# EAGLE design ColourWatch (EAGLE 7.6.0)
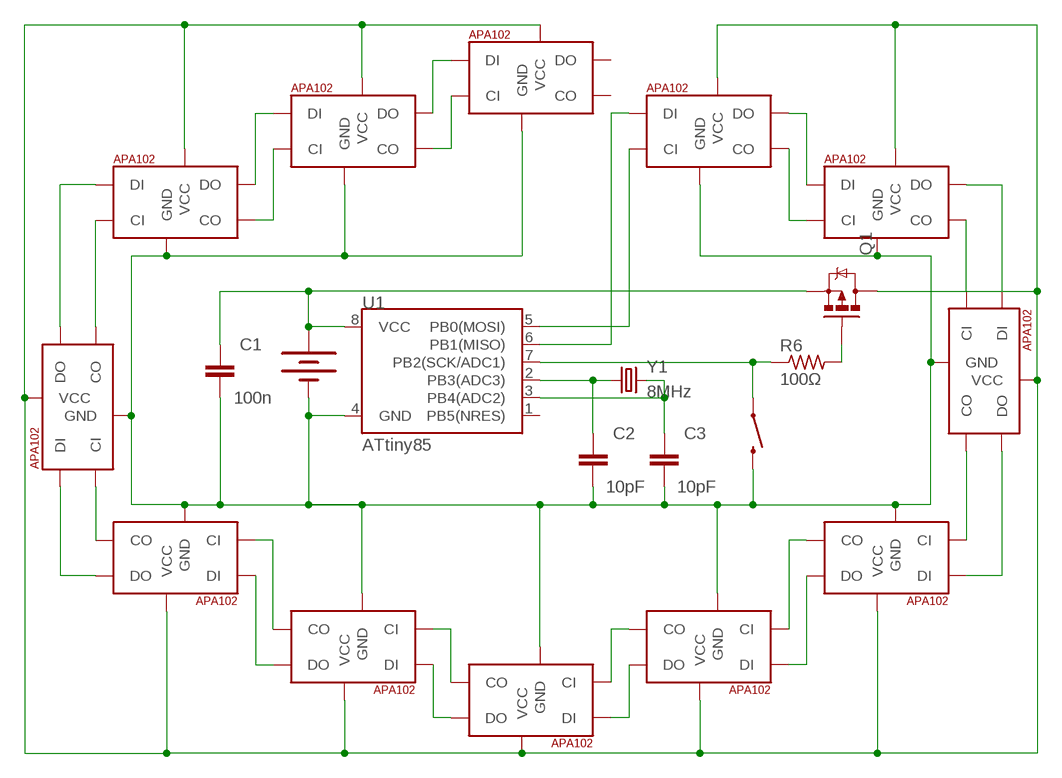
[diagram p0: schematic, sheet 1]

## Parts
1  APA1022020  [APA102_2020]
2  APA1022020  [APA102_2020]
3  APA1022020  [APA102_2020]
4  APA1022020  [APA102_2020]
5  APA1022020  [APA102_2020]
6  APA1022020  [APA102_2020]
7  APA1022020  [APA102_2020]
8  APA1022020  [APA102_2020]
9  APA1022020  [APA102_2020]
10  APA1022020  [APA102_2020]
11  APA1022020  [APA102_2020]
12  APA1022020  [APA102_2020]
BAT1  20mm coincell  BATTERY20MM_4LEGS  [BATTCON_20MM_4LEGS]
C1  100n  CAP0603-CAP  [0603-CAP]
C2  10pF  CAP0603-CAP  [0603-CAP]
C3  10pF  CAP0603-CAP  [0603-CAP]
Q1  MOSFET-PCHANNELSMD  [SOT23-3]
R6  100Ω  R-US_M0805  [M0805]
S2  SWITCH-MOMENTARY-2SMD  [TACTILE-SWITCH-SMD]
U1  ATtiny85  ATTINY45TINY45-20-SMT  [SO08-EIAJ]
Y1  8MHz  CRYSTALCRYSTAL-SMD-5X3-16MHZ  [CRYSTAL-SMD-5X3]

## Nets
N$1: 2.CL_OUT(CO) 3.C_IN(CI)
N$2: 3.D_OUT(DO) 4.D_IN(DI)
N$3: 1.CL_OUT(CO) 2.C_IN(CI)
N$4: 1.D_OUT(DO) 2.D_IN(DI)
N$6: 2.D_OUT(DO) 3.D_IN(DI)
N$7: 4.CL_OUT(CO) 5.C_IN(CI)
N$8: 4.D_OUT(DO) 5.D_IN(DI)
N$9: 1.GND 2.GND 3.GND 4.GND 5.GND 6.GND 7.GND 8.GND 9.GND 10.GND 11.GND 12.GND BAT1.NEGATIVE(-) C1.2 C2.2 C3.2 S2.3 U1.4(GND)
N$10: C3.1 U1.3(PB4(ADC2)) Y1.3
N$11: C2.1 U1.2(PB3(ADC3)) Y1.1
N$12: R6.1 S2.1 U1.7(PB2(SCK/ADC1))
N$13: BAT1.POSITIVE@1(+) BAT1.POSITIVE@2(+) BAT1.POSITIVE@3(+) BAT1.POSITIVE@4(+) C1.1 Q1.2(S) U1.8(VCC)
N$14: 1.V_CC(VCC) 2.V_CC(VCC) 3.V_CC(VCC) 4.V_CC(VCC) 5.V_CC(VCC) 6.V_CC(VCC) 7.V_CC(VCC) 8.V_CC(VCC) 9.V_CC(VCC) 10.V_CC(VCC) 11.V_CC(VCC) 12.V_CC(VCC) Q1.3(D)
N$17: 1.D_IN(DI) U1.6(PB1(MISO))
N$18: 5.CL_OUT(CO) 6.C_IN(CI)
N$19: 5.D_OUT(DO) 6.D_IN(DI)
N$20: 6.D_OUT(DO) 7.D_IN(DI)
N$21: 6.CL_OUT(CO) 7.C_IN(CI)
N$22: 7.D_OUT(DO) 8.D_IN(DI)
N$23: 7.CL_OUT(CO) 8.C_IN(CI)
N$25: 8.D_OUT(DO) 9.D_IN(DI)
N$26: 3.CL_OUT(CO) 4.C_IN(CI)
N$27: 9.D_OUT(DO) 10.D_IN(DI)
N$28: 11.D_OUT(DO) 12.D_IN(DI)
N$29: 11.CL_OUT(CO) 12.C_IN(CI)
N$30: 10.CL_OUT(CO) 11.C_IN(CI)
N$31: 10.D_OUT(DO) 11.D_IN(DI)
N$33: 9.CL_OUT(CO) 10.C_IN(CI)
N$35: 8.CL_OUT(CO) 9.C_IN(CI)
N$36: 1.C_IN(CI) U1.5(PB0(MOSI))
N$48: Q1.1(G) R6.2
Unconnected: 12.CL_OUT(CO) 12.D_OUT(DO) U1.1(PB5(NRES))

## Library data of the parts
1-12 = jos-ph:APA102: APA102C 5050 RGB LED -- Adafruit DotStar Single LED Pixel Product Page: https://www.adafruit.com/products/2343 Datasheet: https://cdn-shop.adafruit.com/product-files/2343/APA102C.pdf
BAT1 = SparkFun-Electromechanical:BATTERY: Battery Holders Various common sizes : AA, AAA, 18650 (PRT-12895), 20mm coin cell and 12mm coin cell. 20MM_4LEGS, BATT-10373; PROD_ID: BATT-10373
C1-C3 = SparkFun-Capacitors:CAP: Capacitor Standard 0603 ceramic capacitor, and 0.1" leaded capacitor.
Q1 = SparkFun-DiscreteSemi:MOSFET-PCHANNEL: Generic PMOSFET IRLML2244 - TRANS-11153 (SOT-23 -20V -4.3A) (1.Gate 2.Source 3.Drain) FQP27P06 - COM-10349 <http://www.sparkfun.com/products/10349> (TO-220 -60V -27A) (1.Gate 2.Source 3.Drain)
R6 = adafruit:R-US_: RESISTOR, American symbol
S2 = SparkFun-Electromechanical:SWITCH-MOMENTARY-2: Various NO switches- pushbuttons, reed, etc; PROD_ID: SWCH-08247
U1 = SparkFun-DigitalIC:ATTINY45: Atmel 8-pin 2/4/8kB flash uC; PROD_ID: IC-08922; VALUE: Tiny45-20-SMT
Y1 = SparkFun-FreqCtrl:CRYSTAL: Various standard crystals. Proven footprints.; PROD_ID: XTAL-08218

## Board
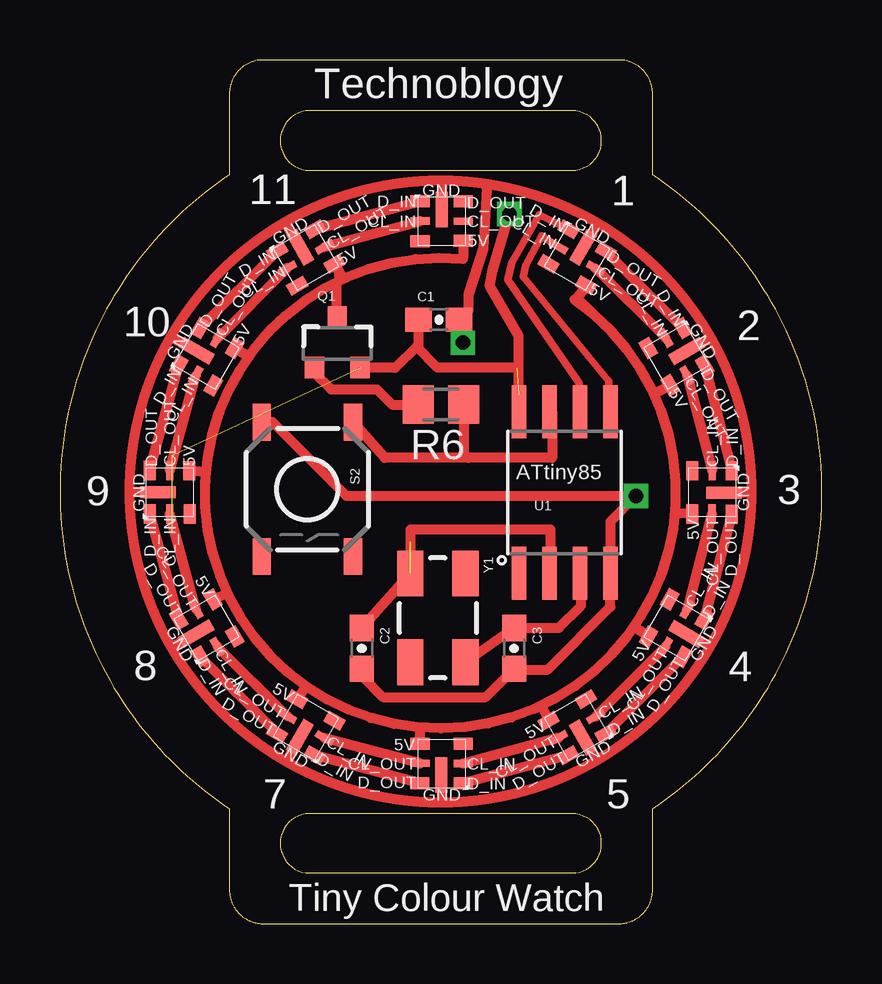
[diagram p1: board, top side]
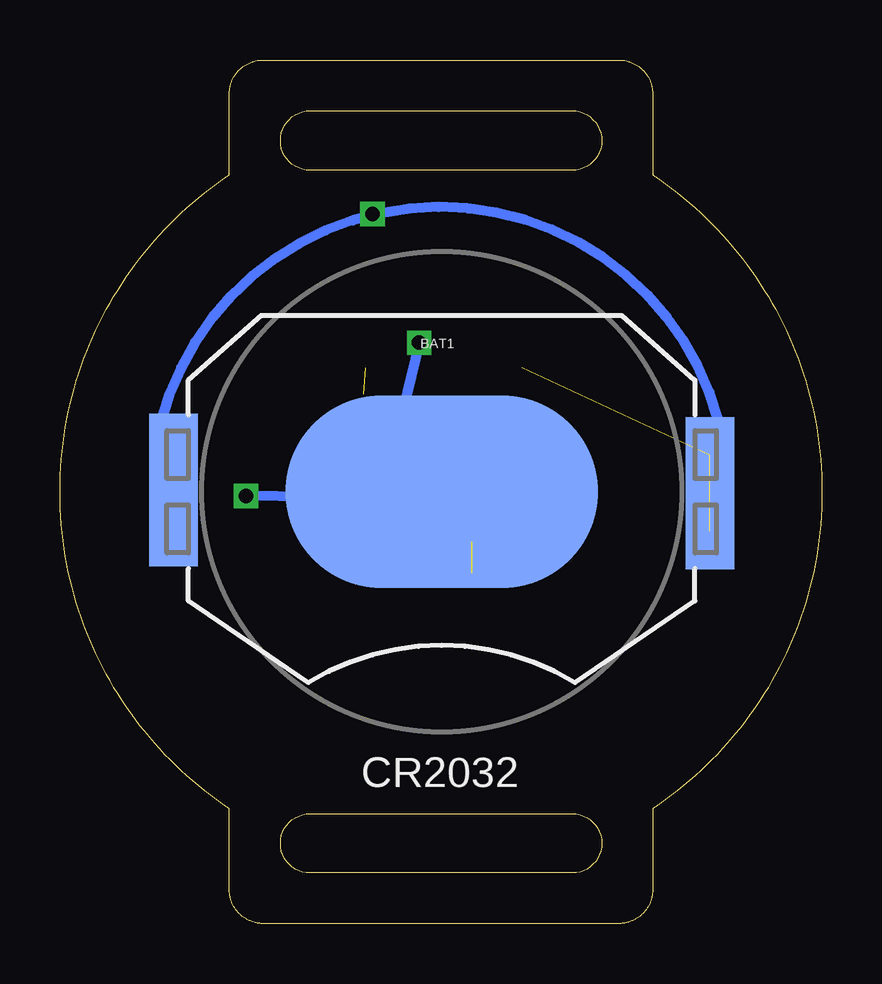
[diagram p2: board, bottom side, seen from below]

Size 31.75 x 35.98 mm. Coordinates in mm from the lower left corner, seen from the top.
Outline: 7.23,0.74 7.2,0.78 7.18,0.82 7.17,0.86 7.15,0.9 7.13,0.95 7.12,0.99 7.11,1.04 7.09,1.08 7.08,1.13 7.08,1.17 7.07,1.22 7.06,1.27 7.06,1.31 7.06,1.36 7.06,4.79 6.79,4.97 6.53,5.15 6.28,5.35 6.02,5.54 5.77,5.74 5.53,5.95 5.29,6.16 5.05,6.37 4.82,6.59 4.6,6.82 4.37,7.05 4.16,7.28 3.94,7.52 3.74,7.76 3.33,8.25 3.14,8.51 2.77,9.03 2.59,9.29 2.42,9.56 2.25,9.84 2.09,10.11 1.78,10.68 1.63,10.96 1.5,11.26 1.36,11.55 1.23,11.85 1.11,12.15 0.99,12.45 0.88,12.75 0.78,13.06 0.68,13.37 0.59,13.69 0.5,14.01 0.42,14.33 0.35,14.65 0.29,14.97 0.22,15.3 0.17,15.63 0.09,16.29 0.05,16.63 0.03,16.97 0.01,17.31 0,17.65 0,18.34 0.01,18.68 0.03,19.02 0.05,19.35 0.09,19.69 0.13,20.02 0.17,20.35 0.22,20.68 0.29,21.01 0.35,21.33 0.42,21.66 0.5,21.98 0.59,22.29 0.68,22.61 0.78,22.92 0.88,23.23 0.99,23.53 1.11,23.84 1.23,24.14 1.36,24.43 1.5,24.73 1.63,25.02 1.78,25.31 1.93,25.59 2.09,25.87 2.25,26.15 2.42,26.42 2.59,26.69 2.77,26.96 3.14,27.48 3.33,27.73 3.53,27.98 3.74,28.23 3.94,28.47 4.16,28.7 4.37,28.94 4.6,29.17 4.82,29.39 5.05,29.61 5.29,29.83 5.53,30.03 5.77,30.24 6.02,30.44 6.28,30.64 6.53,30.83 6.79,31.01 7.06,31.19 7.06,34.62 7.06,34.67 7.06,34.72 7.07,34.76 7.08,34.81 7.08,34.86 7.09,34.9 7.11,34.95 7.12,34.99 7.13,35.04 7.15,35.08 7.17,35.12 7.18,35.16 7.2,35.2 7.23,35.24 7.25,35.28 7.27,35.32 7.3,35.36 7.32,35.4 7.35,35.43 7.38,35.47 7.41,35.5 7.44,35.54 7.5,35.6 7.53,35.63 7.57,35.66 7.6,35.69 7.64,35.72 7.68,35.74 7.72,35.77 7.75,35.79 7.79,35.81 7.83,35.83 7.88,35.85 7.92,35.87 7.96,35.89 8,35.91 8.05,35.92 8.09,35.93 8.14,35.94 8.23,35.96 8.28,35.97 8.32,35.98 8.37,35.98 8.42,35.98 23.33,35.98 23.38,35.98 23.43,35.98 23.48,35.97 23.52,35.96 23.61,35.94 23.66,35.93 23.7,35.92 23.75,35.91 23.79,35.89 23.83,35.87 23.88,35.85 23.92,35.83 23.96,35.81 24,35.79 24.04,35.77 24.07,35.74 24.11,35.72 24.15,35.69 24.18,35.66 24.22,35.63 24.25,35.6 24.28,35.57 24.31,35.54 24.34,35.5 24.37,35.47 24.4,35.43 24.43,35.4 24.45,35.36 24.48,35.32 24.5,35.28 24.52,35.24 24.55,35.2 24.57,35.16 24.58,35.12 24.6,35.08 24.62,35.04 24.63,34.99 24.65,34.95 24.66,34.9 24.67,34.86 24.68,34.81 24.68,34.76 24.69,34.72 24.69,34.67 24.69,34.62 24.69,31.19 24.96,31.01 25.22,30.83 25.48,30.64 25.73,30.44 25.98,30.24 26.46,29.83 26.7,29.61 26.93,29.39 27.15,29.17 27.38,28.94 27.59,28.7 27.81,28.47 28.02,28.23 28.22,27.98 28.42,27.73 28.61,27.48 28.98,26.96 29.16,26.69 29.33,26.42 29.5,26.15 29.66,25.87 29.82,25.59 29.97,25.31 30.12,25.02 30.25,24.73 30.39,24.43 30.52,24.14 30.64,23.84 30.76,23.53 30.87,23.23 30.97,22.92 31.07,22.61 31.16,22.29 31.25,21.98 31.33,21.66 31.4,21.33 31.46,21.01 31.53,20.68 31.58,20.35 31.62,20.02 31.66,19.69 31.7,19.35 31.74,18.68 31.75,18.34 31.75,17.65 31.74,17.31 31.7,16.63 31.66,16.29 31.58,15.63 31.53,15.3 31.46,14.97 31.4,14.65 31.33,14.33 31.25,14.01 31.16,13.69 31.07,13.37 30.97,13.06 30.87,12.75 30.76,12.45 30.64,12.15 30.52,11.85 30.39,11.55 30.25,11.26 30.12,10.96 29.97,10.68 29.82,10.39 29.66,10.11 29.5,9.84 29.33,9.56 29.16,9.29 28.98,9.03 28.61,8.51 28.42,8.25 28.22,8.01 28.02,7.76 27.81,7.52 27.59,7.28 27.38,7.05 27.15,6.82 26.93,6.59 26.7,6.37 26.46,6.16 25.98,5.74 25.73,5.54 25.48,5.35 25.22,5.15 24.96,4.97 24.69,4.79 24.69,1.36 24.69,1.31 24.69,1.27 24.68,1.22 24.68,1.17 24.67,1.13 24.66,1.08 24.65,1.04 24.63,0.99 24.62,0.95 24.6,0.9 24.58,0.86 24.57,0.82 24.55,0.78 24.52,0.74 24.5,0.7 24.48,0.66 24.45,0.62 24.43,0.58 24.4,0.55 24.37,0.51 24.34,0.48 24.31,0.45 24.28,0.41 24.25,0.38 24.22,0.35 24.18,0.32 24.15,0.29 24.11,0.27 24.07,0.24 24.04,0.22 24,0.19 23.96,0.17 23.92,0.15 23.88,0.13 23.83,0.11 23.79,0.09 23.75,0.08 23.66,0.05 23.61,0.04 23.57,0.03 23.52,0.02 23.48,0.01 23.43,0.01 23.38,0 23.33,0 8.42,0 8.37,0 8.32,0.01 8.28,0.01 8.23,0.02 8.18,0.03 8.14,0.04 8.09,0.05 8.05,0.06 8,0.08 7.96,0.09 7.92,0.11 7.88,0.13 7.83,0.15 7.79,0.17 7.75,0.19 7.72,0.22 7.68,0.24 7.64,0.27 7.6,0.29 7.57,0.32 7.53,0.35 7.5,0.38 7.47,0.41 7.44,0.45 7.41,0.48 7.38,0.51 7.35,0.55 7.32,0.58 7.3,0.62 7.27,0.66 7.25,0.7
Outline: 21.5,33.86 10.24,33.86 10.08,33.82 9.93,33.76 9.79,33.7 9.65,33.61 9.54,33.5 9.43,33.39 9.34,33.25 9.28,33.11 9.21,32.96 9.18,32.79 9.18,32.45 9.21,32.29 9.28,32.14 9.34,32 9.43,31.86 9.54,31.75 9.65,31.64 9.79,31.55 9.93,31.49 10.08,31.42 10.24,31.39 21.5,31.39 21.66,31.42 21.81,31.49 21.96,31.55 22.09,31.64 22.2,31.75 22.31,31.86 22.4,32 22.47,32.14 22.53,32.29 22.56,32.45 22.56,32.79 22.53,32.96 22.47,33.11 22.4,33.25 22.31,33.39 22.2,33.5 22.09,33.61 21.96,33.7 21.81,33.76 21.66,33.82 21.5,33.86
Outline: 21.5,4.58 10.24,4.58 10.08,4.55 9.93,4.48 9.79,4.42 9.65,4.33 9.54,4.22 9.43,4.11 9.34,3.97 9.28,3.83 9.21,3.68 9.18,3.52 9.18,3.17 9.21,3.01 9.28,2.86 9.34,2.72 9.43,2.58 9.54,2.47 9.65,2.36 9.79,2.27 9.93,2.21 10.08,2.15 10.24,2.11 21.5,2.11 21.66,2.15 21.81,2.21 21.96,2.27 22.09,2.36 22.2,2.47 22.31,2.58 22.4,2.72 22.47,2.86 22.53,3.01 22.56,3.17 22.56,3.52 22.53,3.68 22.47,3.83 22.4,3.97 22.31,4.11 22.2,4.22 22.09,4.33 21.96,4.42 21.81,4.48 21.66,4.55 21.5,4.58
Copper layers (1*16): Top 0.035mm / dielectric 1.5mm / Bottom 0.035mm
Design rules "default": minimum track width 10mil, minimum drill 24mil, track to track 8mil, track to pad 8mil, pad to pad 8mil, via to via 8mil, smd to smd 8mil, copper to edge 40mil, drill to drill 8mil, minimum pad ring 10mil, minimum via ring 8mil, stop-mask expansion 4mil, vias tented up to drill 0mil, thermal gap 10mil

### Footprints (pad centres in the part's own frame; a part is rotated, then mirrored left to right if it is on the bottom)
APA102_2020 = smd 0.8 x 0.3: C_IN -0.9,0; CL_OUT 0.9,-0.01 | smd 0.8 x 0.5: D_IN -0.9,0.825; D_OUT 0.91,0.825; GND1 -0.9,-0.835; V_CC 0.9,-0.825 | smd 0.5 x 1.48: GND 0.01,0.485
BATTCON_20MM_4LEGS = smd 13 x 8: NEGATIVE 0,0 | smd 2.032 x 3.175: POSITIVE@1 -11.176,1.651; POSITIVE@2 -11.176,-1.524; POSITIVE@3 11.176,1.524; POSITIVE@4 11.176,-1.651
0603-CAP = smd 1.1 x 1: 1 -0.85,0; 2 0.85,0
SOT23-3 = smd 0.8 x 0.9: 1 -0.95,-1; 2 0.95,-1; 3 0,1.1
M0805 = smd 1.3 x 1.6: 1 -0.95,0; 2 0.95,0
TACTILE-SWITCH-SMD = smd 1.524 x 0.762: 1 -2.794,1.905; 2 2.794,1.905; 3 -2.794,-1.905; 4 2.794,-1.905
SO08-EIAJ = smd 0.61 x 2.21: 1 -1.905,-3.378; 2 -0.635,-3.378; 3 0.635,-3.378; 4 1.905,-3.378; 5 1.905,3.353; 6 0.635,3.353; 7 -0.635,3.353; 8 -1.905,3.353
CRYSTAL-SMD-5X3 = smd 1.9 x 1.1: 1 -1.85,-1.15; 2 1.85,-1.15; 3 1.85,1.15; 4 -1.85,1.15

### Placement (x,y rotation side)
1  21.55,27.76 330 top
2  25.69,23.62 300 top
3  27.17,17.97 270 top
4  25.69,12.32 240 top
5  21.55,8.18 210 top
6  15.9,6.67 180 top
7  10.25,8.18 150 top
8  6.11,12.32 120 top
9  4.57,17.97 90 top
10  6.11,23.62 60 top
11  10.25,27.76 30 top
12  15.9,29.27 0 top
BAT1  15.85,18 0 bottom
C1  15.78,25.16 0 top
C2  12.57,11.47 270 top
C3  18.92,11.47 270 top
Q1  11.55,24.17 0 top
R6  15.87,21.63 180 top
S2  10.31,18.1 270 top
U1  21.03,17.97 0 top
Y1  15.74,12.74 270 top

### Tracks (layer width: path | path; a pad name or v marks a point on that pad's centre or on a via)
N$1
  Top 0.406: 2.CL_OUT 3.C_IN
N$2
  Top 0.406: 3.D_OUT 4.D_IN
N$3
  Top 0.406: 1.CL_OUT 2.C_IN
N$4
  Top 0.406: 1.D_OUT 2.D_IN
N$5
  Bottom 0.406: 4.31,20.99 arc-156 27.81,19.72
N$6
  Top 0.406: 2.D_OUT 3.D_IN
N$7
  Top 0.406: 4.CL_OUT 5.C_IN
N$8
  Top 0.406: 4.D_OUT 5.D_IN
N$9  (via drill 0.6)
  Top 0.127: 15.97,29.76 15.95,30.92 14.35,30.9 12.09,30.42 10.16,29.63 9.83,29.48 9.45,29.1 | 11.GND 9.39,29.25 8.63,28.71 7.49,27.93 6.45,26.89 5.41,25.69 4.92,24.93 4.72,24.37 | 10.GND 4.95,24.17 4.57,24.45 3.5,22.03 3.04,20.36 2.97,17.97 | 9.GND 2.87,18 3.04,16.09 3.4,14.24 4.19,12.33 4.39,11.92 4.75,11.57 | 8.GND 4.95,11.47 4.7,11.52 5.36,10.35 6.58,8.95 7.92,7.73 8.89,7.05 9.47,6.82 | 7.GND 9.45,6.74 10.94,5.98 13.26,5.32 15.13,5.04 15.9,5.07 16.71,5.04 18.56,5.32 20.9,6.06 22.42,6.82 5.GND 22.32,6.82 23.77,7.71 25.14,8.95 26.29,10.32 27.02,11.59 | 4.GND 27.15,11.57 27.94,13.3 28.62,15.4 28.8,17.26 28.75,17.97 28.8,18.55 28.6,20.51 27.96,22.64 27.15,24.4 | 2.GND 27.15,24.4 | 1.GND 22.4,29.17 24.28,27.88 25.83,26.25 26.62,25.13 27.15,24.4 | 15.97,30.95 17.62,30.87 17.78,30.64
  Top 0.254: 12.GND 15.97,29.76 15.97,30.95
  Top 0.406: 12.GND 15.95,30.9 | 6.GND arc-90 15.9,6.17 15.9,5.07 | 7.GND 9.47,6.82 | 8.GND 4.75,11.57 | 9.GND 2.97,17.97 | 10.GND 4.72,24.37 | 11.GND 9.45,29.1 | 1.GND 22.4,29.15 | 2.GND 27.07,24.37 | 3.GND 28.75,17.97 | 4.GND 27.02,11.59 | 5.GND 22.32,6.9 | 17.78,30.64 17.64,28.14 17.01,26.2 17.01,25.54 C1.2 16.82,24.46 v16.79,24.21 | S2.3 8.86,20.89 11.93,17.82 v24,17.82 22.93,16.75 U1.4 | 22.92,14.79 U1.4 | 12.57,10.83 C2.2 12.57,10.32 13.46,9.44 17.74,9.44 C3.2 18.96,10.58 20.32,10.58 22.93,13.19 U1.4
  Bottom 0.406: BAT1.NEGATIVE 15.11,18.73 15.11,19.09 14.25,19.95 17.02,19.11 | 17.02,19.11 21.36,17.79 v24,17.82 | v16.79,24.21 17.8,20 17.78,19.98 17.78,19.86 17.02,19.11
N$10
  Top 0.406: 21.64,14.59 U1.3 21.71,14.54 21.71,13.25 20.79,12.32 C3.1 Y1.3
N$11  (2 unrouted)
  Top 0.406: U1.2 20.44,14.59 20.44,16.42 14.6,16.42 14.6,14.64 | C2.1 Y1.1
N$12
  Top 0.406: U1.7 20.51,21.32 20.51,19.41 17.01,19.41 | 17.01,19.41 13.52,19.41 S2.1 | R6.1 16.82,19.6 17.01,19.41
N$13  (via drill 0.6)  (3 unrouted)
  Top 0.406: v18.73,29.57 18.03,27.22 17.9,26.58 19.11,24.48 19.11,21.44 U1.8 19.12,22.06 | C1.1 14.93,24.12 14.86,24.04 | 14.86,24.04 13.97,23.15 12.52,23.15 Q1.2 | 19.03,23.17 15.73,23.17 14.86,24.04
  Bottom 0.203: v18.73,29.57 21.08,28.74 23.49,27.22 25.27,25.44 26.41,23.79 27.17,21.88 27.81,20.36 BAT1.POSITIVE@1
  Bottom 0.406: BAT1.POSITIVE@1 27.09,17.79 | 27.09,17.79 27.17,15.28 | BAT1.POSITIVE@2 27.09,17.79
N$14
  Top 0.127: 8.V_CC 6.96,13.78 6.22,15.91 | 6.22,15.91 6.09,17.51 6.09,18.81 | 6.09,18.81 6.09,18.86 9.V_CC 6.09,18.81 | 6.09,18.81 6.29,19.71 6.6,21.09 7.18,22.57 7.9,23.66 | 7.9,23.66 10.V_CC | 7.9,23.66 7.87,23.66 9.37,25.34 10.77,26.3 11.53,26.71 | 11.53,26.71 11.V_CC | 12.V_CC 16.76,27.67 15.36,27.7 13.61,27.49 12.26,27.06 11.53,26.71 | 7.V_CC 10.26,9.87 | 10.26,9.87 12.26,8.78 14.04,8.29 15.01,8.17 | 15.01,8.17 6.V_CC | 5.V_CC 20.09,9.03 | 20.09,9.03 17.95,8.32 16.43,8.14 15.01,8.17 | 4.V_CC 23.9,12.23 | 23.9,12.23 23.36,11.47 21.89,10.15 20.6,9.33 20.09,9.03 | 3.V_CC 25.65,17.06 | 25.65,17.06 25.02,14.39 24.51,13.19 23.9,12.23 | 2.V_CC 24.71,22.16 | 24.71,22.16 25.5,19.82 25.65,17.92 25.65,17.06 | 1.V_CC 21.48,26.05 22.63,24.98 23.95,23.43 24.71,22.16 | 6.22,15.91 6.85,14.06 7.97,12.03 9.22,10.71 10.26,9.87
  Top 0.406: 20.39,8.44 20.09,9.03 | Q1.3 11.53,25.14 11.53,26.71
N$16
  Top 0.406: 16.81,28.41 16.81,27.8
N$17
  Top 0.305: 1.D_IN 19.97,29.53 18.83,27.53 18.67,26.83 21.64,22.52 U1.6
N$18
  Top 0.406: 5.CL_OUT 6.C_IN
N$19
  Top 0.406: 5.D_OUT 6.D_IN
N$20
  Top 0.406: 6.D_OUT 7.D_IN
N$21
  Top 0.406: 6.CL_OUT 7.C_IN
N$22
  Top 0.406: 7.D_OUT 8.D_IN
N$23
  Top 0.406: 7.CL_OUT 8.C_IN
N$24
  Top 0.406: 11.48,27.49 11.73,26.94
N$25
  Top 0.406: 8.D_OUT 9.D_IN
N$26
  Top 0.406: 3.CL_OUT 4.C_IN
N$27
  Top 0.406: 9.D_OUT 10.D_IN
N$28
  Top 0.406: 11.D_OUT 12.D_IN
N$29
  Top 0.406: 11.CL_OUT 12.C_IN
N$30
  Top 0.406: 10.CL_OUT 11.C_IN
N$31
  Top 0.406: 10.D_OUT 11.D_IN
N$32
  Top 0.406: 7.26,23.99 7.77,23.71
N$33
  Top 0.406: 9.CL_OUT 10.C_IN
N$34
  Top 0.406: 5.43,18.88 6.04,18.83
N$35
  Top 0.406: 8.CL_OUT 9.C_IN
N$36
  Top 0.305: U1.5 22.86,22.59 19.3,26.96 19.41,27.43 20.08,28.66 1.C_IN
N$37
  Top 0.406: 6.4,13.52 6.88,13.73
N$38
  Top 0.406: 10.03,9.56 10.18,9.79
N$39
  Top 0.406: 14.98,7.51 15.01,8.04
N$40
  Top 0.406: 24.53,11.98 24,12.31
N$41
  Top 0: 29.5,26.15 29.33,26.42 29.16,26.69 28.98,26.96 28.61,27.48 28.42,27.73 28.22,27.98 28.02,28.23 27.81,28.47 27.59,28.7 27.38,28.94 27.15,29.17 26.93,29.39 26.7,29.61 26.46,29.83 25.98,30.24 25.73,30.44 25.48,30.64 25.22,30.83 24.96,31.01 24.69,31.19 24.69,34.62 24.69,34.67 24.69,34.72 24.68,34.76 24.68,34.81 24.67,34.86 24.66,34.9 24.65,34.95 24.63,34.99 24.62,35.04 24.6,35.08 24.58,35.12 24.57,35.16 24.55,35.2 24.52,35.24 24.5,35.28 24.48,35.32 24.45,35.36 24.43,35.4 24.4,35.43 24.37,35.47 24.34,35.5 24.31,35.54 24.28,35.57 24.25,35.6 24.22,35.63 24.18,35.66 24.15,35.69 24.11,35.72 24.07,35.74 24.04,35.77 24,35.79 23.96,35.81 23.92,35.83 23.88,35.85 23.83,35.87 23.79,35.89 23.75,35.91 23.7,35.92 23.66,35.93 23.61,35.94 23.52,35.96 23.48,35.97 23.43,35.98 23.38,35.98 23.33,35.98 8.42,35.98 8.37,35.98 8.32,35.98 8.28,35.97 8.23,35.96 8.14,35.94 8.09,35.93 8.05,35.92 8,35.91 7.96,35.89 7.92,35.87 7.88,35.85 7.83,35.83 7.79,35.81 7.75,35.79 7.72,35.77 7.68,35.74 7.64,35.72 7.6,35.69 7.57,35.66 7.53,35.63 7.5,35.6 7.44,35.54 7.41,35.5 7.38,35.47 7.35,35.43 7.32,35.4 7.3,35.36 7.27,35.32 7.25,35.28 7.23,35.24 7.2,35.2 7.18,35.16 7.17,35.12 7.15,35.08 7.13,35.04 7.12,34.99 7.11,34.95 7.09,34.9 7.08,34.86 7.08,34.81 7.07,34.76 7.06,34.72 7.06,34.67 7.06,34.62 7.06,31.19 6.79,31.01 6.53,30.83 6.28,30.64 6.02,30.44 5.77,30.24 5.53,30.03 5.29,29.83 5.05,29.61 4.82,29.39 4.6,29.17 4.37,28.94 4.16,28.7 3.94,28.47 3.74,28.23 3.53,27.98 3.33,27.73 3.14,27.48 2.77,26.96 2.59,26.69 2.42,26.42 2.25,26.15 2.09,25.87 1.93,25.59 1.78,25.31 1.63,25.02 1.5,24.73 1.36,24.43 1.23,24.14 1.11,23.84 0.99,23.53 0.88,23.23 0.78,22.92 0.68,22.61 0.59,22.29 0.5,21.98 0.42,21.66 0.35,21.33 0.29,21.01 0.22,20.68 0.17,20.35 0.13,20.02 0.09,19.69 0.05,19.35 0.03,19.02 0.01,18.68 0,18.34 0,17.65 0.01,17.31 0.03,16.97 0.05,16.63 0.09,16.29 0.17,15.63 0.22,15.3 0.29,14.97 0.35,14.65 0.42,14.33 0.5,14.01 0.59,13.69 0.68,13.37 0.78,13.06 0.88,12.75 0.99,12.45 1.11,12.15
N$42
  Top 0.406: 26.39,17.08 25.75,17.11
N$43
  Top 0: 21.5,33.86 10.24,33.86 10.08,33.82 9.93,33.76 9.79,33.7 9.65,33.61 9.54,33.5 9.43,33.39 9.34,33.25 9.28,33.11 9.21,32.96 9.18,32.79 9.18,32.45 9.21,32.29 9.28,32.14 9.34,32 9.43,31.86 9.54,31.75 9.65,31.64 9.79,31.55 9.93,31.49 10.08,31.42 10.24,31.39 21.5,31.39 21.66,31.42 21.81,31.49 21.96,31.55 22.09,31.64 22.2,31.75 22.31,31.86 22.4,32 22.47,32.14 22.53,32.29 22.56,32.45 22.56,32.79 22.53,32.96 22.47,33.11 22.4,33.25 22.31,33.39 22.2,33.5 22.09,33.61 21.96,33.7 21.81,33.76 21.66,33.82 21.5,33.86
N$44
  Top 0: 21.5,4.58 10.24,4.58 10.08,4.55 9.93,4.48 9.79,4.42 9.65,4.33 9.54,4.22 9.43,4.11 9.34,3.97 9.28,3.83 9.21,3.68 9.18,3.52 9.18,3.17 9.21,3.01 9.28,2.86 9.34,2.72 9.43,2.58 9.54,2.47 9.65,2.36 9.79,2.27 9.93,2.21 10.08,2.15 10.24,2.11 21.5,2.11 21.66,2.15 21.81,2.21 21.96,2.27 22.09,2.36 22.2,2.47 22.31,2.58 22.4,2.72 22.47,2.86 22.53,3.01 22.56,3.17 22.56,3.52 22.53,3.68 22.47,3.83 22.4,3.97 22.31,4.11 22.2,4.22 22.09,4.33 21.96,4.42 21.81,4.48 21.66,4.55 21.5,4.58
N$45
  Top 0.406: 25.45,22.44 24.84,22.11
N$46
  Top 0.406: 21.97,26.61 21.54,26.07 22.15,25.49
N$47
  Top 0.406: 21.43,26 arc-331 16.79,27.7
N$48
  Top 0.406: Q1.1 10.6,22.96 11.3,22.26 13.2,22.26 13.84,21.63 R6.2
N$50
  Top 0: 7.53,22.81 8.13,23.97
N$55
  Top 0: 24.22,12.54 23.62,12.01
(copper drawn outside any net)
  shapes: Top circle x1

### Text on the board
tNames: Technoblogy | Tiny Colour Watch
bNames: CR2032